# Altium project BrushServo_MG995.PrjPcb
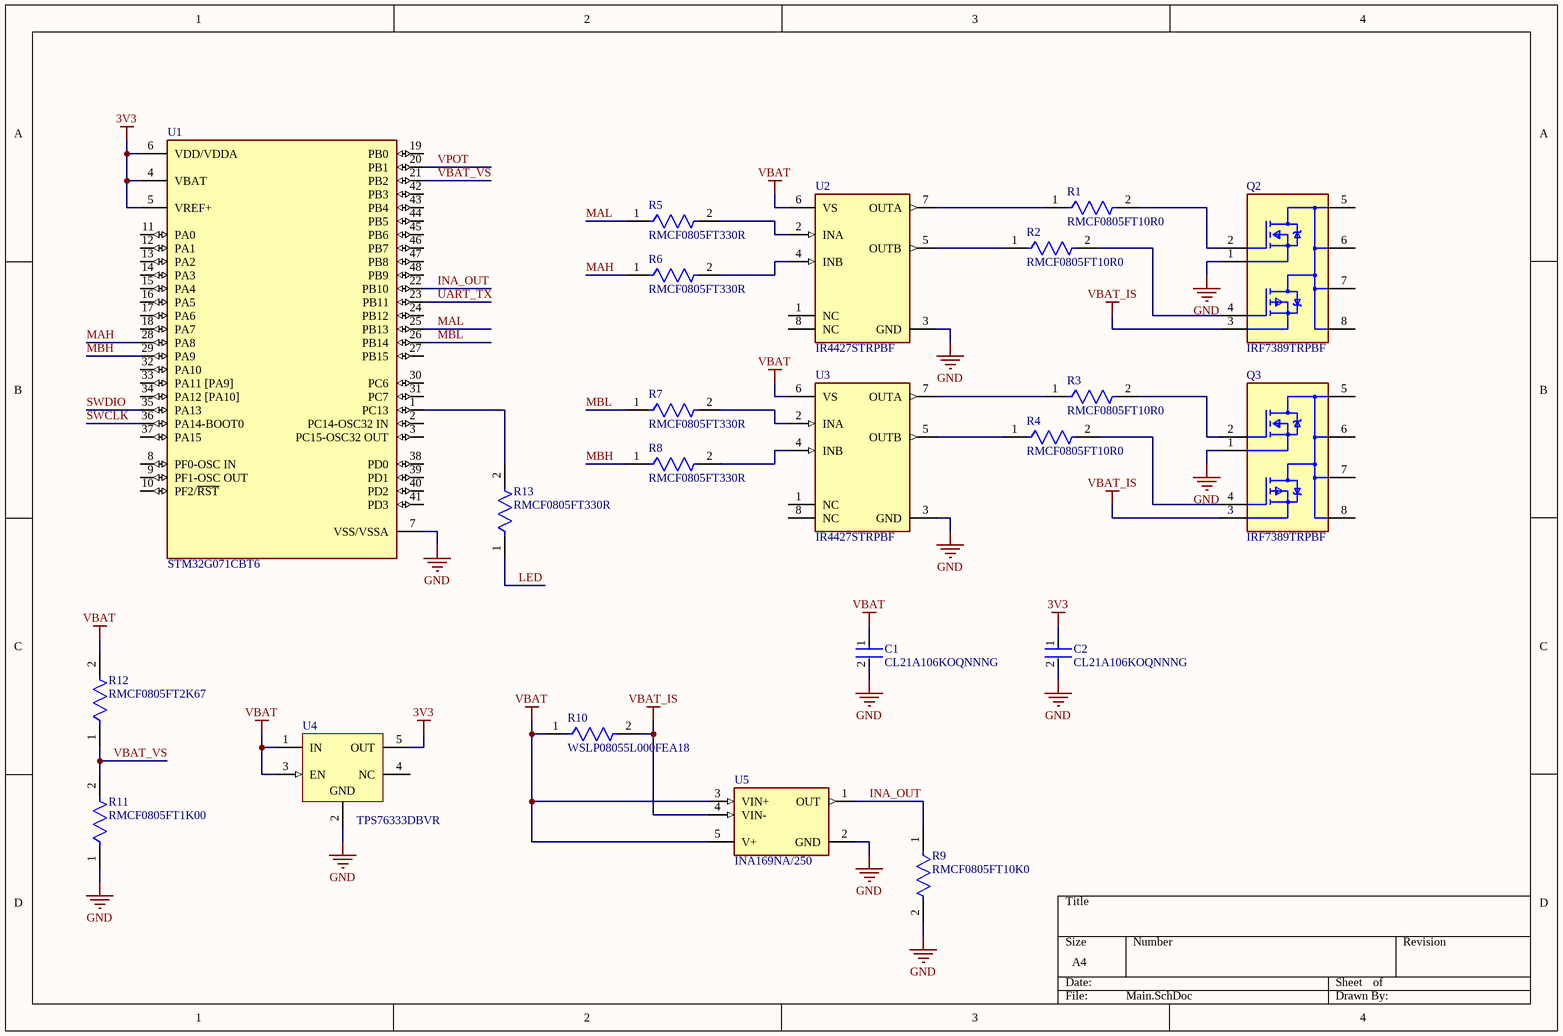
[diagram p0: Main.SchDoc]
1 sheet, 22 parts. Net scope: global (net labels, ports and power ports of the same name join across sheets).
Board file: BrushServo_MG995.PcbDoc

## Sheet Main.SchDoc
size A4; SheetNumber: 1; SheetTotal: 1

### Parts
C1  CL21A106KOQNNNG  [FP-CL21-IPC_C]
C2  CL21A106KOQNNNG  [FP-CL21-IPC_C]
Q2  IRF7389TRPBF  [FP-PG-DSO-8-MFG]
Q3  IRF7389TRPBF  [FP-PG-DSO-8-MFG]
R1  RMCF0805FT10R0  [FP-RMCF0805-IPC_C]
R2  RMCF0805FT10R0  [FP-RMCF0805-IPC_C]
R3  RMCF0805FT10R0  [FP-RMCF0805-IPC_C]
R4  RMCF0805FT10R0  [FP-RMCF0805-IPC_C]
R5  RMCF0805FT330R  [FP-RMCF0805-IPC_C]
R6  RMCF0805FT330R  [FP-RMCF0805-IPC_C]
R7  RMCF0805FT330R  [FP-RMCF0805-IPC_C]
R8  RMCF0805FT330R  [FP-RMCF0805-IPC_C]
R9  RMCF0805FT10K0  [FP-RMCF0805-IPC_C]
R10  WSLP08055L000FEA18  [FP-WSLP0805-IPC_C]
R11  RMCF0805FT1K00  [FP-RMCF0805-IPC_C]
R12  RMCF0805FT2K67  [FP-RMCF0805-IPC_C]
R13  RMCF0805FT330R  [FP-RMCF0805-IPC_C]
U1  STM32G071CBT6  [FP-LQFP48-5B-MFG]
U2  IR4427STRPBF  [FP-PG-DSO-8-MFG]
U3  IR4427STRPBF  [FP-PG-DSO-8-MFG]
U4  TPS76333DBVR  [DBV0005A_N]
U5  INA169NA/250  [FP-DBV0005A-MFG]

### Nets
3V3: C2.1 U1.4(VBAT) U1.5(VREF+) U1.6(VDD/VDDA) U4.5(OUT)
GND: C1.2 C2.2 Q2.1(S1) Q3.1(S1) R9.2 R11.1 U1.7(VSS/VSSA) U2.3(GND) U3.3(GND) U4.2(GND) U5.2(GND)
VBAT: C1.1 R10.1 R12.2 U2.6(VS) U3.6(VS) U4.1(IN) U4.3(EN) U5.3(VIN+) U5.5(V+)
VBAT_IS: Q2.3(S2) Q3.3(S2) R10.2 U5.4(VIN-)
INA_OUT: R9.1 U1.22(PB10) U5.1(OUT)
LED: R13.1
MAH: R6.1 U1.28(PA8)
MAL: R5.1 U1.25(PB13)
MBH: R8.1 U1.29(PA9)
MBL: R7.1 U1.26(PB14)
SWCLK: U1.36(PA14-BOOT0)
SWDIO: U1.35(PA13)
UART_TX: U1.23(PB11)
VBAT_VS: R11.2 R12.1 U1.21(PB2)
VPOT: U1.20(PB1)
NetQ2_2: Q2.2(G1) R1.2
NetQ2_4: Q2.4(G2) R2.2
NetQ3_2: Q3.2(G1) R3.2
NetQ3_4: Q3.4(G2) R4.2
NetR1_1: R1.1 U2.7(OUTA)
NetR2_1: R2.1 U2.5(OUTB)
NetR3_1: R3.1 U3.7(OUTA)
NetR4_1: R4.1 U3.5(OUTB)
NetR5_2: R5.2 U2.2(INA)
NetR6_2: R6.2 U2.4(INB)
NetR7_2: R7.2 U3.2(INA)
NetR8_2: R8.2 U3.4(INB)
NetR13_2: R13.2 U1.1(PC13)

Not connected (* = marked no-connect by the designer): Q2 5(D) 6(D) 7(D) 8(D); Q3 5(D) 6(D) 7(D) 8(D); U1 2(PC14-OSC32_IN) 3(PC15-OSC32_OUT) 8(PF0-OSC_IN) 9(PF1-OSC_OUT) 10(PF2/~{RST}) 11(PA0) 12(PA1) 13(PA2) 14(PA3) 15(PA4) 16(PA5) 17(PA6) 18(PA7) 19(PB0) 24(PB12) 27(PB15) 30(PC6) 31(PC7) 32(PA10) 33(PA11_[PA9]) 34(PA12_[PA10]) 37(PA15) 38(PD0) 39(PD1) 40(PD2) 41(PD3) 42(PB3) 43(PB4) 44(PB5) 45(PB6) 46(PB7) 47(PB8) 48(PB9); U2 1(NC) 8(NC); U3 1(NC) 8(NC); U4 4(NC)

### Library data of the parts
C1 C2 = CMP-13271-002240-1: CL21 Series 0805 10uF 16V ±10% Tolerance X5R Multilayer Ceramic Chip Capacitor; Capacitance: 10uF; Case Code (Metric): 2012; Package Quantity: 3000; Width: 0.049inch; Mount: Surface Mount; Depth: 1.25mm; Material: Ceramic; Min Operating Temperature: -55°C; Thickness: 0.053inch; Tolerance: 10%; Case Code (Imperial): 0805; Packaging: Tape and Reel; Voltage Rating: 16V; Case/Package: 0805; Height: 1.25mm; Voltage: 16V; Max Operating Temperature: 85°C; Length: 2mm; Dielectric: X5R
Q2 Q3 = CMP-32901-000903-1: MOSFET N/P-CH 30V 8-SOIC; Rds On Max: 29mR; Max Power Dissipation: 2.5W; Threshold Voltage: 1V; Input Capacitance: 650pF; FET Type: N and P-Channel; Continuous Drain Current (ID): 7.3A; Gate to Source Voltage (Vgs): 20V; Case/Package: SO; Number of Pins: 8; Max Operating Temperature: 150°C; Mount: Surface Mount; Max Dual Supply Voltage: 30V; REACH SVHC: No SVHC; Series: HEXFET®; Contact Plating: Tin; Drain to Source Voltage (Vdss): 30V; Lead Free: Lead Free; Min Operating Temperature: -55°C; Halogen Free: Halogen Free; RoHS Compliant: Yes; Packaging: Cut Tape
R1-R4 = CMP-26527-000052-1: 10Ω ±1% 0.125W 0805 Thick Film Chip Resistor AEC-Q200 compliant; Temperature Coefficient: 100ppm/°C; Max Power Dissipation: 125mW; Resistance: 10R; Depth: 1.25mm; Packaging: Tape and Reel; Mount: Surface Mount; Height: 0.026inch; Min Operating Temperature: -55°C; RoHS Compliant: Yes; Number of Terminations: 2; Contact Plating: Tin; Case Code (Metric): 2012; Power Rating: 125mW; Construction: Rectangular; Tolerance: 1%; Military Standard: Not; Features: Automotive AEC-Q200; Max Operating Temperature: 155°C; Lead Free: Lead Free; Case/Package: 0805; Size Code: 0805; Length: 0.079inch; Case Code (Imperial): 0805; Width: 0.049inch; Resistor Type: Thick Film; Series: RMCF; Radiation Hardening: No
R5-R8 R13 = CMP-26527-000132-1: 330Ω ±1% 0.125W 0805 Thick Film Chip Resistor AEC-Q200 compliant; Temperature Coefficient: 100ppm/°C; Max Power Dissipation: 125mW; Resistance: 330R; Height: 0.026inch; Tolerance: 1%; Packaging: Tape and Reel; Case/Package: 0805; RoHS Compliant: Yes; Min Operating Temperature: -55°C; Radiation Hardening: No; Construction: Rectangular; Features: Automotive AEC-Q200; Width: 0.049inch; Case Code (Metric): 2012; Case Code (Imperial): 0805; Series: RMCF; Depth: 1.25mm; Lead Free: Lead Free; Number of Terminations: 2; Military Standard: Not; Length: 0.079inch; Mount: Surface Mount; Resistor Type: Thick Film; Max Operating Temperature: 155°C; Contact Plating: Tin
R9 = CMP-26527-000121-1: RES 10K OHM 1% 1/8W 0805; Power Rating: 125mW; Resistance: 10kR; Temperature Coefficient: 100ppm/°C; Depth: 1.25mm; Construction: Rectangular; Packaging: Tape and Reel; Tolerance: 1%; Lead Free: Lead Free; Case/Package: 0805; RoHS Compliant: Yes; Series: RMCF; Width: 0.049inch; Max Power Dissipation: 125mW; Contact Plating: Tin; Height: 0.026inch; Mount: Surface Mount; Resistor Type: Thick Film; Size Code: 0805; Length: 2mm; Max Operating Temperature: 155°C; Features: Automotive AEC-Q200; Radiation Hardening: No; Case Code (Imperial): 0805; Min Operating Temperature: -55°C; Case Code (Metric): 2012; Number of Terminations: 2; Military Standard: Not
R10 = CMP-02407-013125-1: RES 0.005 OHM 1% 1W 0805; Resistance: 5mR; Temperature Coefficient: 110ppm/°C; Length: 0.08inch; Number of Terminations: 2; Height: 0.023inch; Max Operating Temperature: 170°C; Features: Moisture Resistant; Resistor Type: Metal Strip; Tolerance: 1%; Min Operating Temperature: -65°C; Power Rating: 1W; Width: 0.05inch; Max Power Dissipation: 1W; Case Code (Metric): 2012; Case/Package: 0805; Series: WSLP-HP; Case Code (Imperial): 0805; RoHS Compliant: Yes; Resistance Tolerance: 1%; Packaging: Cut Tape
R11 = CMP-26527-002331-1: 1kΩ ±1% 0.125W 0805 Thick Film Chip Resistor AEC-Q200 compliant; Resistance: 1kR; Max Power Dissipation: 125mW; Temperature Coefficient: 100ppm/°C; Contact Plating: Tin; Case Code (Imperial): 0805; Radiation Hardening: No; Case/Package: 0805; Min Operating Temperature: -55°C; Construction: Rectangular; Tolerance: 1%; Length: 2mm; Features: Automotive AEC-Q200; Height: 0.026inch; Mount: Surface Mount; Series: RMCF; Number of Terminations: 2; Width: 0.049inch; Packaging: Tape and Reel; Size Code: 0805; Lead Free: Lead Free; Depth: 1.25mm; Power Rating: 125mW; Resistor Type: Thick Film; Case Code (Metric): 2012; Military Standard: Not; Max Operating Temperature: 155°C; RoHS Compliant: Yes
R12 = CMP-26527-000749-1: 2.67kΩ ±1% 0.125W 0805 Thick Film Chip Resistor AEC-Q200 compliant; Resistance: 2.67kR; Max Power Dissipation: 125mW; Temperature Coefficient: 100ppm/°C; Case Code (Imperial): 0805; Mount: Surface Mount; Case/Package: 0805; Contact Plating: Tin; Max Operating Temperature: 155°C; Height: 0.026inch; Radiation Hardening: No; Case Code (Metric): 2012; Number of Terminations: 2; Packaging: Tape and Reel; Series: RMCF; Length: 0.079inch; RoHS Compliant: Yes; Tolerance: 1%; Min Operating Temperature: -55°C; Lead Free: Lead Free; Features: Automotive AEC-Q200; Width: 0.049inch; Resistor Type: Thick Film
U1 = CMP-12105-000052-1: IC MCU 32BIT 128KB FLASH 48LQFP; Manufacturer: STMicroelectronics; Max Junction Temp: +105°C; Number Of I2C Channels: 2; Number Of Adc Channels: 17; Frequency: 64MHz; Description: ARM® Cortex®-M0+ STM32G0 Microcontroller IC 32-Bit 64MHz 128KB (128K x 8) FLASH 48-LQFP (7x7); Memory Size: 128KBytes; Interface: I2C,SPI,UART,USART,USB,LIN,IrDA,I2S,Other; Ram Size: 36KBytes; Min Supply Voltage: 1.55V; Number Of Cores: 1; Max Supply Voltage: 3.6V; Core Architecture: ARM Cortex-M0+; Standoff Height: 0.05mm; Number Of Timers/Counters: 12; Number Of I/Os: 44; Data Bus Width: 32bits; Number Of Uart Channels: 5; Temperature Range Low: -40°C; Package: LQFP48-5B; Lead Free: Yes; Temperature Range High: +85°C; Octopart: https://octopart.com/stm32g071cbt6-stmicroelectronics-96627027; Ambient Temperature Range Low: -40°C; Automotive: No; Device Class L1: Integrated Circuits (ICs); Height: 1.6mm; ComponentLink2URL: https://www.st.com/resource/en/datasheet/stm32g071cb.pdf; Manufacturer Part Number: STM32G071CBT6; Number Of Usb Channels: 2; Device Class L3: Microcontrollers; ComponentLink2Description: Datasheet; Number Of Spi Channels: 2; Memory Type: FLASH; Device Class L2: Embedded Processors and Controllers; Digikey Description: IC MCU 32BIT 128KB FLASH 48LQFP; Ambient Temperature Range High: +85°C; Category: IC; Number Of A/D Converters: 1; RoHS: TRUE; Temperature: -40°C to +85°C
U2 U3 = CMP-32851-000004-1: IC GATE DRVR LOW-SIDE 8SOIC; Manufacturer: Infineon; Nominal Supply Current: 100uA; Rise Time: 15ns; Standoff Height: 0.1mm; Number Of Drivers: 2; Description: IC DRIVER DUAL LOW SIDE 8SOIC; Output Voltage: 6-20V; Fall Time: 10ns; Turn Off Delay Time: 65ns; Max Supply Voltage: 20V; Max Power Dissipation: 0.625W; Max Junction Temp: +150°C; Output Current: 1.5A; Min Supply Voltage: 6V; Turn On Delay Time: 85ns; Footprint Url: https://www.infineon.com/dgdl/Infineon-po-8leadsoic-P-v01_00-EN.pdf?fileId=5546d462580663ef0158068b4ad80177; Automotive: No; Height: 1.75mm; Ambient Temperature Range Low: -40°C; Temperature Range High: +150°C; Ambient Temperature Range High: +125°C; Package: PG-DSO-8; ComponentLink2Description: Datasheet; Digikey Description: IC GATE DRVR LOW-SIDE 8SOIC; Temperature: to +150°C; Number Of Outputs: 2; Device Class L2: Power Management ICs; Manufacturer Part Number: IR4427STRPBF; ComponentLink2URL: https://www.infineon.com/dgdl/ir4426.pdf?fileId=5546d462533600a4015355d60b491822; Category: IC; RoHS: TRUE; Device Class L1: Integrated Circuits (ICs); Ipc Land Pattern Name: SOIC127P600X155-8; Lead Free: Yes; Device Class L3: Gate Drivers; Octopart: https://octopart.com/ir4427strpbf-infineon-65873145
U4 = CMP-0394-00569-2: Single Output LDO, 150 mA, Fixed 3.3 V Output, 2.7 to 10 V Input, with Low IQ, 5-pin SOT-23 (DBV), -40 to 125 degC, Green (RoHS & no Sb/Br); Manufacturer: Texas Instruments; Vout Adj(Min)(V): 3.3; SubFamily: Single Channel LDO; Iout(Max)(A): 0.15; Vdo(Typ)(mV): 300; Accuracy(%): 3; Vin(Max)(V): 10; Vin(Min)(V): 2.7; Iq(Typ)(mA): 0.08; ComponentLink2Description: Datasheet; ComponentLink1Description: Manufacturer URL; ComponentLink3URL: http://www.ti.com/litv/pdf/mpds018i; PackageReference: DBV0005A; ComponentLink3Description: Package Specification; DatasheetVersion: SLVS181H; PartNumber: TPS76333DBVR; Eco-Plan: Green (RoHS & no Sb/Br); Code_JEDEC: MO-178; ComponentLink1URL: http://www.ti.com/; PackageDescription: 5-Pin Plastic Small Outline, Body 1.60 Ãƒâ€” 2.90 mm, Pitch 0.95 mm; Vout Adj(Max)(V): 3.3; Mounting Technology: Surface Mount; ComponentLink2URL: http://www.ti.com/general/docs/lit/getliterature.tsp?genericPartNumber=TPS76333&fileType=pdf; Fixed Output Options(V): 3.3; PackageVersion: 4073253-4/K
U5 = CMP-04910-000104-1: IC CURRENT MONITOR 0.5% SOT23-5; Operating Supply Voltage: 28V; Common Mode Rejection Ratio: 100dB; Input Offset Voltage (Vos): 1mV; Min Input Voltage: 2.7V; Number of Channels: 1; Bandwidth: 440kHz; Max Input Voltage: 60V; Nominal Supply Current: 60uA; Operating Supply Current: 125uA; Input Bias Current: 10uA; REACH SVHC: No SVHC; Radiation Hardening: No; Height: 1.15mm; RoHS Compliant: Yes; Mount: Surface Mount; Case/Package: SOT-23; Length: 2.9mm; Number of Amplifiers: 1; Packaging: Tape and Reel; Number of Pins: 5; Lead Free: Lead Free; Width: 1.6mm; Series: INA169; Weight: 0.000617oz; Supply Current: 60uA; Accuracy: 0.5%; Max Operating Temperature: 125°C; Number of Elements: 1; Max Supply Voltage: 60V; Min Supply Voltage: 2.7V; Min Operating Temperature: -40°C